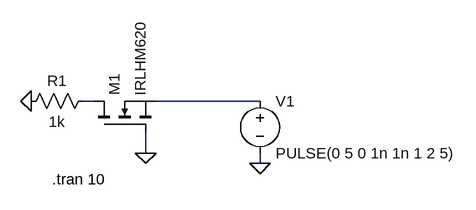
[diagram p0: schematic common gate.asc]
common gate.asc, the LTspice schematic file:
Version 4.1
SHEET 1 880 680
WIRE 96 144 80 144
WIRE 352 144 192 144
WIRE 176 224 176 192
WIRE 352 240 352 224
FLAG 352 240 0
FLAG 176 224 0
FLAG 0 144 0
SYMBOL nmos 96 192 R270
SYMATTR InstName M1
SYMATTR Value IRLHM620
SYMBOL voltage 352 128 R0
WINDOW 123 0 0 Left 0
WINDOW 39 0 0 Left 0
SYMATTR InstName V1
SYMATTR Value PULSE(0 5 0 1n 1n 1 2 5)
SYMBOL res 96 128 R90
WINDOW 0 0 56 VBottom 2
WINDOW 3 32 56 VTop 2
SYMATTR InstName R1
SYMATTR Value 1k
TEXT 32 264 Left 2 !.tran 10

The netlist it stands for:
* common gate.asc
M1 N001 0 N002 N002 IRLHM620
V1 N002 0 PULSE(0 5 0 1n 1n 1 2 5)
R1 N001 0 1k
.model NMOS NMOS
.model PMOS PMOS
.lib standard.mos
.tran 10
.backanno
.end